# EAGLE design uv-meter (EAGLE 6.1)
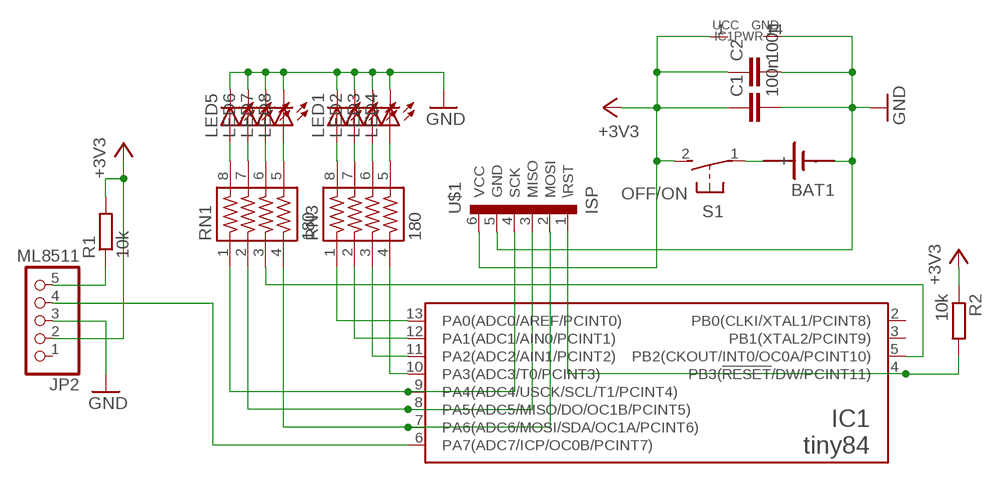
[diagram p0: schematic, sheet 1]

## Parts
BAT1  SN2032  [SN2032]
C1  100n  C-EUC0805K  [C0805K]
C2  100n  C-EUC0805K  [C0805K]
IC1  tiny84  ATTINY24/44/84-SSU  [SOIC14]
JP2  ML8511  PINHD-1X5  [1X05]
LED1  LEDSML0805  [SML0805]
LED2  LEDSML0805  [SML0805]
LED3  LEDSML0805  [SML0805]
LED4  LEDSML0805  [SML0805]
LED5  LEDSML0805  [SML0805]
LED6  LEDSML0805  [SML0805]
LED7  LEDSML0805  [SML0805]
LED8  LEDSML0805  [SML0805]
R1  10k  R-EU_M0805  [M0805]
R2  10k  R-EU_M0805  [M0805]
RN1  180  744-8NS  [744-8NS]
RN3  180  744-8NS  [744-8NS]
S1  OFF/ON  DTS-3  [DTS-3]
U$1  ISP  POGOPIN-CONNSTANDARD  [POGOPROG-CONN]

## Nets
+3V3: C1.1 C2.1 IC1.1(UCC) JP2.2 R1.2 R2.1 S1.2 U$1.6(VCC)
GND: BAT1.- C1.2 C2.2 IC1.14(GND) JP2.3 LED1.C LED2.C LED3.C LED4.C LED5.C LED6.C LED7.C LED8.C U$1.5(GND)
N$1: LED5.A RN1.8
N$2: JP2.5 R1.1
N$3: LED6.A RN1.7
N$4: LED7.A RN1.6
N$5: LED8.A RN1.5
N$6: LED1.A RN3.8
N$7: LED2.A RN3.7
N$8: BAT1.+ S1.1
N$9: LED3.A RN3.6
N$10: LED4.A RN3.5
N$11: IC1.10(PA3(ADC3/T0/PCINT3)) RN3.4
N$12: IC1.11(PA2(ADC2/AIN1/PCINT2)) RN3.3
N$13: IC1.12(PA1(ADC1/AIN0/PCINT1)) RN3.2
N$14: IC1.5(PB2(CKOUT/INT0/OC0A/PCINT10)) RN1.3
N$15: IC1.13(PA0(ADC0/AREF/PCINT0)) RN3.1
N$16: IC1.7(PA6(ADC6/MOSI/SDA/OC1A/PCINT6)) RN1.4 U$1.2(MOSI)
N$17: IC1.8(PA5(ADC5/MISO/DO/OC1B/PCINT5)) RN1.2 U$1.3(MISO)
N$18: IC1.9(PA4(ADC4/USCK/SCL/T1/PCINT4)) RN1.1 U$1.4(SCK)
N$19: IC1.6(PA7(ADC7/ICP/OC0B/PCINT7)) JP2.4
N$20: IC1.4(PB3(!RESET!/DW/PCINT11)) R2.2 U$1.1(\RST)
Unconnected: IC1.2(PB0(CLKI/XTAL1/PCINT8)) IC1.3(PB1(XTAL2/PCINT9)) JP2.1

## Library data of the parts
BAT1 = sn2032:SN2032: LI BATTERY
C1 C2 = rcl:C-EU: CAPACITOR, European symbol
IC1 = atmel_tiny24-44-84tiny48-88mega48-88-168-328:ATTINY24/44/84
JP2 = pinhead:PINHD-1X5: PIN HEADER
LED1-LED8 = led:LED: LED OSRAM: - CHIPLED LG R971, LG N971, LY N971, LG Q971, LY Q971, LO R971, LY R971 LH N974, LH R974 LS Q976, LO Q976, LY Q976 LO Q996 - Hyper CHIPLED LW Q18S LB Q993, LB Q99A, LB R99A - SideLED LS A670, LO A670, LY A670, LG A670, LP A670 LB A673, LV A673, LT A673, LW A673 LH A674 LY A675 LS A676, LA A676, LO A676, LY A676, LW A676 LS A679, LY A679, LG A679 - Hyper Micro SIDELED® LS Y876, LA Y876, LO Y876, LY Y876 LT Y87S - SmartLED LW L88C, LW L88S LB L89C, LB L89S, LG L890 LS L89K, LO L89K, LY L89K LS L896, LA L896, LO L896, LY L896 - TOPLED LS T670, LO T670, LY T670, LG T670, LP T670 LSG T670, LSP T670, LSY T670, LOP T670, LYG T670 LG T671, LOG T671, LSG T671 LB T673, LV T673, LT T673, LW T673 LH T674 LS T676, LA T676, LO T676, LY T676, LB T676, LH T676, LSB T676, LW T676 LB T67C, LV T67C, LT T67C, LS T67K, LO T67K, LY T67K, LW E67C LS E67B, LA E67B, LO E67B, LY E67B, LB E67C, LV E67C, LT E67C LW T67C LS T679, LY T679, LG T679 LS T770, LO T770, LY T770, LG T770, LP T770 LB T773, LV T773, LT T773, LW T773 LH T774 LS E675, LA E675, LY E675, LS T675 LS T776, LA T776, LO T776, LY T776, LB T776 LHGB T686 LT T68C, LB T68C - Hyper Mini TOPLED® LB M676 - Mini TOPLED Santana® LG M470 LS M47K, LO M47K, LY M47K Source: http://www.osram.convergy.de LUXEON: - LUMILED® LXK2-PW12-R00, LXK2-PW12-S00, LXK2-PW14-U00, LXK2-PW14-V00 LXK2-PM12-R00, LXK2-PM12-S00, LXK2-PM14-U00 LXK2-PE12-Q00, LXK2-PE12-R00, LXK2-PE12-S00, LXK2-PE14-T00, LXK2-PE14-U00 LXK2-PB12-K00, LXK2-PB12-L00, LXK2-PB12-M00, LXK2-PB14-N00, LXK2-PB14-P00, LXK2-PB14-Q00 LXK2-PR12-L00, LXK2-PR12-M00, LXK2-PR14-Q00, LXK2-PR14-R00 LXK2-PD12-Q00, LXK2-PD12-R00, LXK2-PD12-S00 LXK2-PH12-R00, LXK2-PH12-S00 LXK2-PL12-P00, LXK2-PL12-Q00, LXK2-PL12-R00 Source: www.luxeon.com KINGBRIGHT: KA-3528ASYC Source: www.kingbright.com
R1 R2 = rcl:R-EU_: RESISTOR, European symbol
RN1 RN3 = resistor-array (1):744-8: CTS 744 Series 4 Resistors, 8 Terminations
S1 = _MY_OWN_LIB:DTS-3
U$1 = Protofusion:POGOPIN-CONN: Protofusion custom pogo pin programming header

## Board
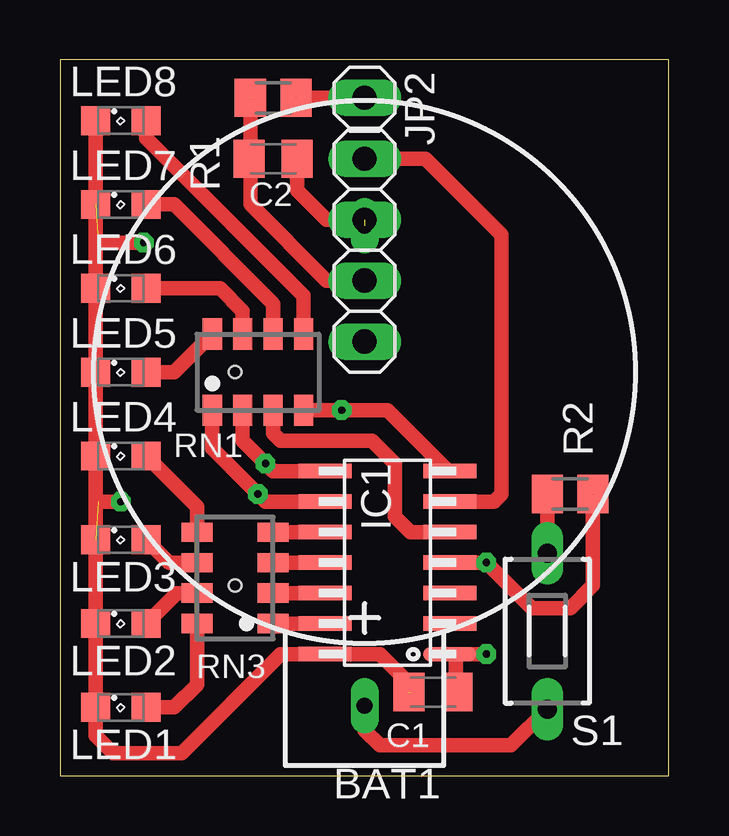
[diagram p1: board, top side]
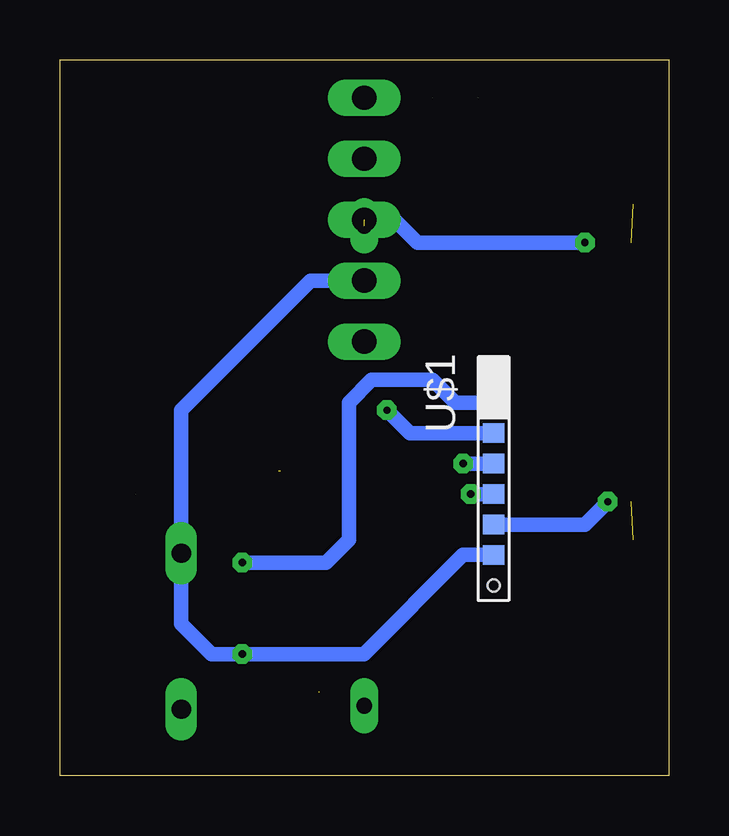
[diagram p2: board, bottom side, seen from below]

Size 25.38 x 29.83 mm. Coordinates in mm from the lower left corner, seen from the top.
Outline: 0,0 25.38,0 25.38,29.83 0,29.83 0,0
Copper layers (1*16): Top 0.035mm / dielectric 1.5mm / Bottom 0.035mm
Design rules: minimum track width 10mil, minimum drill 24mil, track to track 12mil, track to pad 12mil, pad to pad 12mil, via to via 12mil, smd to smd 10mil, copper to edge 12mil, drill to drill 12mil, minimum pad ring 10mil, minimum via ring 10mil, stop-mask expansion 4mil, vias tented up to drill 0mil, thermal gap 12mil

### Footprints (pad centres in the part's own frame; a part is rotated, then mirrored left to right if it is on the bottom)
SN2032 = drill 0.65 long: + 0,13.9; - 0,-6.1
C0805K = smd 1.3 x 1.6: 1 -1,0; 2 1,0
SOIC14 = smd 0.61 x 2.21: 1 -3.81,-2.603; 2 -2.54,-2.603; 3 -1.27,-2.603; 4 0,-2.603; 5 1.27,-2.603; 6 2.54,-2.603; 7 3.81,-2.603; 8 3.81,2.603; 9 2.54,2.603; 10 1.27,2.603; 11 0,2.603; 12 -1.27,2.603; 13 -2.54,2.603; 14 -3.81,2.603
1X05 = drill 1.016 long: 1 -5.08,0; 2 -2.54,0; 3 0,0; 4 2.54,0; 5 5.08,0
SML0805 = smd 1.2 x 1.2: A 1.05,0; C -1.05,0
M0805 = smd 1.3 x 1.6: 1 -0.95,0; 2 0.95,0
744-8NS = smd 0.8 x 1.3: 1 -1.905,-1.587; 2 -0.635,-1.587; 3 0.635,-1.587; 4 1.905,-1.587; 5 1.905,1.587; 6 0.635,1.587; 7 -0.635,1.587; 8 -1.905,1.587
DTS-3 = drill 0.8 long: 1 -3.25,0; 2 3.25,0
POGOPROG-CONN = smd 0.889 x 0.813: 1 0,3.81; 2 0,2.54; 3 0,1.27; 4 0,0; 5 0,-1.27; 6 0,-2.54 | hole 0.508: 0,5.08; 0,-3.81

### Placement (x,y rotation side)
BAT1  12.7,16.83 180 top
C1  15.56,3.49 180 top
C2  8.89,25.72 0 top
IC1  13.65,8.89 90 top
JP2  12.7,23.18 90 top
LED1  2.54,2.86 0 top
LED2  2.54,6.35 0 top
LED3  2.54,9.84 0 top
LED4  2.54,13.34 0 top
LED5  2.54,16.83 0 top
LED6  2.54,20.32 0 top
LED7  2.54,23.81 0 top
LED8  2.54,27.3 0 top
R1  8.89,28.26 180 top
R2  21.27,11.75 0 top
RN1  8.26,16.83 0 top
RN3  7.3,8.26 90 top
S1  20.32,6.03 90 top
U$1  7.3,11.75 0 bottom

### Tracks (layer width: path | path; a pad name or v marks a point on that pad's centre or on a via)
+3V3  (via drill 0.3)  (1 unrouted)
  Top 0.61: C1.1 16.51,3.54 16.51,5.08 IC1.1 v17.78,5.08 | JP2.2 11.11,20.64 7.94,23.81 7.94,25.67 | R1.2 | 7.94,25.67 C2.1 | 7.94,25.67 R1.2 | R2.1 S1.2
  Bottom 0.61: JP2.2 14.92,20.64 20.32,15.24 S1.2 20.32,6.35 19.05,5.08 v17.78,5.08 12.7,5.08 8.57,9.21 U$1.6
GND  (via drill 0.3)  (4 unrouted)
  Top 0.61: LED1.C LED2.C | LED2.C LED3.C LED4.C LED5.C LED6.C LED7.C LED8.C | 14.61,3.49 14.61,3.81 13.34,5.08 IC1.14 9.21,5.08 5.08,0.95 2.22,0.95 1.49,1.69 LED2.C | v2.54,11.43 1.59,11.43 | JP2.3 11.11,23.18 9.89,24.4 C2.2 | v3.49,22.23 1.59,22.23
  Bottom 0.61: U$1.5 3.49,10.48 v2.54,11.43 | v3.49,22.23 10.48,22.23 11.43,23.18 JP2.3
N$1
  Top 0.61: LED5.A 4.76,16.83 RN1.8
N$2  (1 unrouted)
  Top 0.61: JP2.5 R1.1
N$3
  Top 0.61: RN1.7 7.62,19.37 6.67,20.32 LED6.A
N$4
  Top 0.61: RN1.6 8.89,19.68 4.76,23.81 LED7.A
N$5
  Top 0.61: RN1.5 10.16,20 3.59,26.57 LED8.A
N$6
  Top 0.61: LED1.A 4.76,2.86 5.71,3.81 RN3.8
N$7
  Top 0.61: RN3.7 4.86,7.62 LED2.A
N$8
  Top 0.61: BAT1.+ 12.7,1.91 13.34,1.27 18.81,1.27 S1.1
N$9
  Top 0.61: RN3.6 4.54,8.89 LED3.A
N$10
  Top 0.61: RN3.5 5.71,11.21 LED4.A
N$11
  Top 0.61: RN3.4 IC1.10
N$12
  Top 0.61: IC1.11 RN3.3
N$13
  Top 0.61: RN3.2 IC1.12
N$14
  Top 0.61: RN1.3 8.89,14.29 9.21,13.97 13.02,13.97 13.97,13.02 13.97,10.79 14.61,10.16 IC1.5
N$15
  Top 0.61: IC1.13 RN3.1
N$16  (via drill 0.3)  (1 unrouted)
  Top 0.61: RN1.4 v11.75,15.24 13.65,15.24 16.19,12.7
  Bottom 0.61: U$1.2 10.79,14.29 v11.75,15.24
N$17  (via drill 0.3)
  Top 0.61: RN1.2 7.62,13.97 v8.57,13.02 8.89,12.7 IC1.8
  Bottom 0.61: U$1.3 v8.57,13.02
N$18  (via drill 0.3)
  Top 0.61: RN1.1 6.35,13.65 v8.26,11.75 8.57,11.43 IC1.9
  Bottom 0.61: U$1.4 v8.26,11.75
N$19
  Top 0.61: IC1.6 18.1,11.43 18.41,11.75 18.41,22.54 15.24,25.72 JP2.4
N$20  (via drill 0.3)  (1 unrouted)
  Top 0.61: IC1.4 v17.78,8.89 19.68,6.99 21.27,6.99 22.23,7.94 R2.2
  Bottom 0.61: U$1.1 8.89,15.56 9.84,16.51 12.38,16.51 13.34,15.56 13.34,9.84 14.29,8.89 v17.78,8.89